# EAGLE design sterownik (EAGLE 5.06)
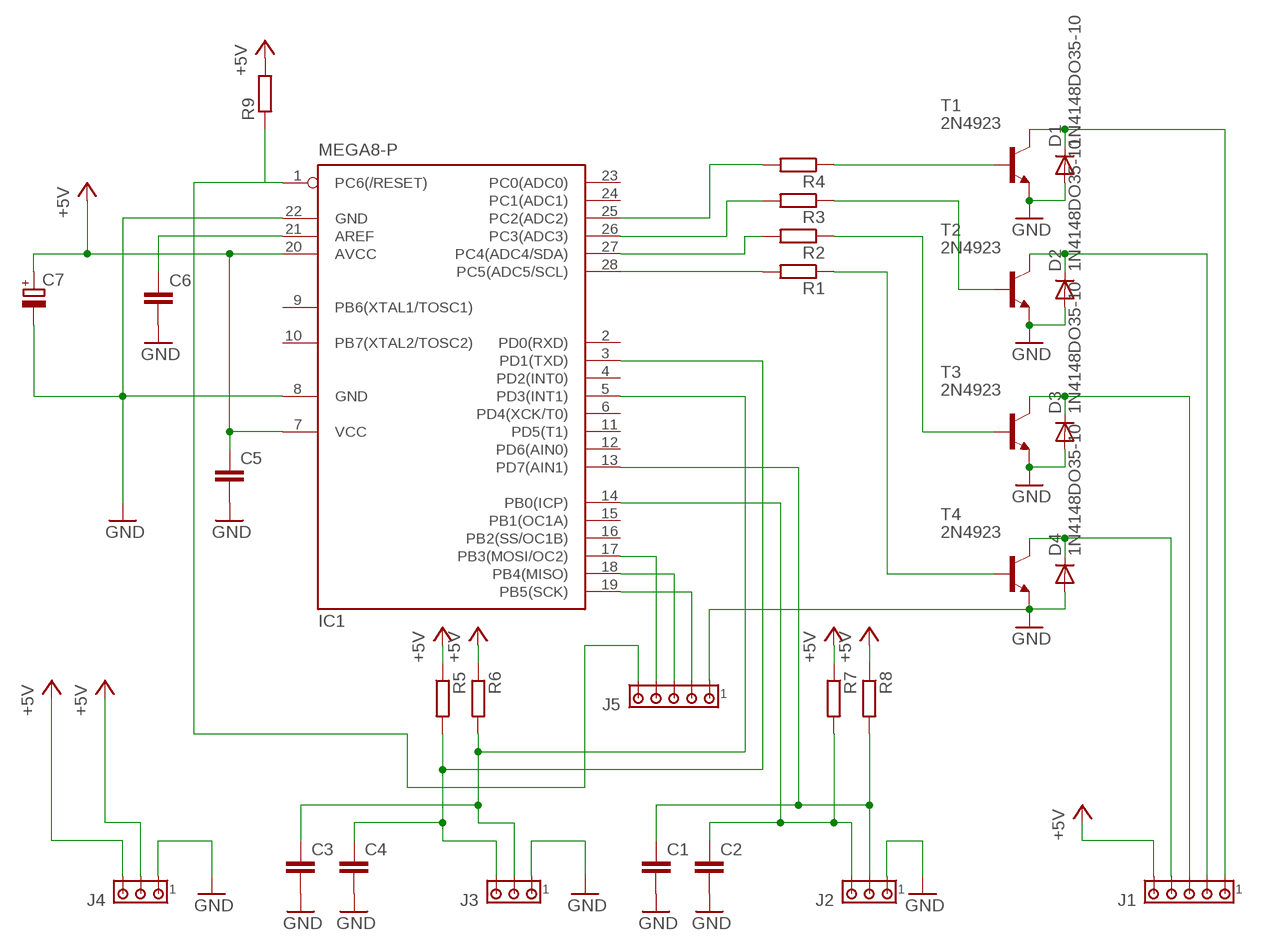
[diagram p0: schematic, sheet 1]

## Parts
C1  C-EU050-025X075  [C050-025X075]
C2  C-EU050-025X075  [C050-025X075]
C3  C-EU050-025X075  [C050-025X075]
C4  C-EU050-025X075  [C050-025X075]
C5  C-EU050-025X075  [C050-025X075]
C6  C-EU050-025X075  [C050-025X075]
C7  CPOL-EUE5-8.5  [E5-8,5]
D1  1N4148DO35-10  [DO35-10]
D2  1N4148DO35-10  [DO35-10]
D3  1N4148DO35-10  [DO35-10]
D4  1N4148DO35-10  [DO35-10]
IC1  MEGA8-P  [DIL28-3]
J1  MTA05-100  [10X05MTA]
J2  MTA03-100  [10X03MTA]
J3  MTA03-100  [10X03MTA]
J4  MTA03-100  [10X03MTA]
J5  MTA05-100  [10X05MTA]
R1  R-EU_0207/10  [0207/10]
R2  R-EU_0207/10  [0207/10]
R3  R-EU_0207/10  [0207/10]
R4  R-EU_0207/10  [0207/10]
R5  R-EU_0207/10  [0207/10]
R6  R-EU_0207/10  [0207/10]
R7  R-EU_0207/10  [0207/10]
R8  R-EU_0207/10  [0207/10]
R9  R-EU_0207/10  [0207/10]
T1  2N4923  [TO126]
T2  2N4923  [TO126]
T3  2N4923  [TO126]
T4  2N4923  [TO126]

## Nets
+5V: C5.1 C7.+ IC1.7(VCC) IC1.20(AVCC) J1.5 J4.2 J4.3 R5.1 R6.1 R7.1 R8.1 R9.2
GND: C1.2 C2.2 C3.2 C4.2 C5.2 C6.2 C7.- D1.A D2.A D3.A D4.A IC1.8(GND) IC1.22(GND) J2.1 J3.1 J4.1 J5.1 T1.1(E) T2.1(E) T3.1(E) T4.1(E)
N$1: IC1.28(PC5(ADC5/SCL)) R1.2
N$2: IC1.27(PC4(ADC4/SDA)) R2.2
N$3: IC1.26(PC3(ADC3)) R3.2
N$4: IC1.25(PC2(ADC2)) R4.2
N$5: R4.1 T1.3(B)
N$6: R3.1 T2.3(B)
N$7: R2.1 T3.3(B)
N$8: R1.1 T4.3(B)
N$9: IC1.1(PC6(/RESET)) J5.5 R9.1
N$11: C3.1 IC1.5(PD3(INT1)) J3.2 R6.2
N$12: D1.C J1.1 T1.2(C)
N$14: D2.C J1.2 T2.2(C)
N$15: D3.C J1.3 T3.2(C)
N$16: D4.C J1.4 T4.2(C)
N$21: IC1.19(PB5(SCK)) J5.2
N$22: IC1.18(PB4(MISO)) J5.3
N$23: C4.1 IC1.3(PD1(TXD)) J3.3 R5.2
N$24: IC1.17(PB3(MOSI/OC2)) J5.4
N$25: C1.1 IC1.13(PD7(AIN1)) J2.2 R8.2
N$26: C2.1 IC1.14(PB0(ICP)) J2.3 R7.2
N$29: C6.1 IC1.21(AREF)
Unconnected: IC1.2(PD0(RXD)) IC1.4(PD2(INT0)) IC1.6(PD4(XCK/T0)) IC1.9(PB6(XTAL1/TOSC1)) IC1.10(PB7(XTAL2/TOSC2)) IC1.11(PD5(T1)) IC1.12(PD6(AIN0)) IC1.15(PB1(OC1A)) IC1.16(PB2(SS/OC1B)) IC1.23(PC0(ADC0)) IC1.24(PC1(ADC1))

## Library data of the parts
C1-C6 = rcl:C-EU: CAPACITOR, European symbol
C7 = rcl:CPOL-EU: POLARIZED CAPACITOR, European symbol
D1-D4 = diode:1N4148: DIODE high speed (Philips)
IC1 = atmel:MEGA8-P: MICROCONTROLLER 8 Kbytes FLASH, 1 kbytes SRAM, 512 bytes EEPROM, USART, 4-channel 10 bit ADC, 2-channel 8 bit ADC Pin compatible with Atmega48, ATMega88, ATMega168 Source: avr.lbr
J1 J5 = con-amp:MTA05-100: AMP connector
J2-J4 = con-amp:MTA03-100: AMP connector
R1-R9 = rcl:R-EU_: RESISTOR, European symbol
T1-T4 = transistor:2N4923: NPN TRANSISTOR

## Board
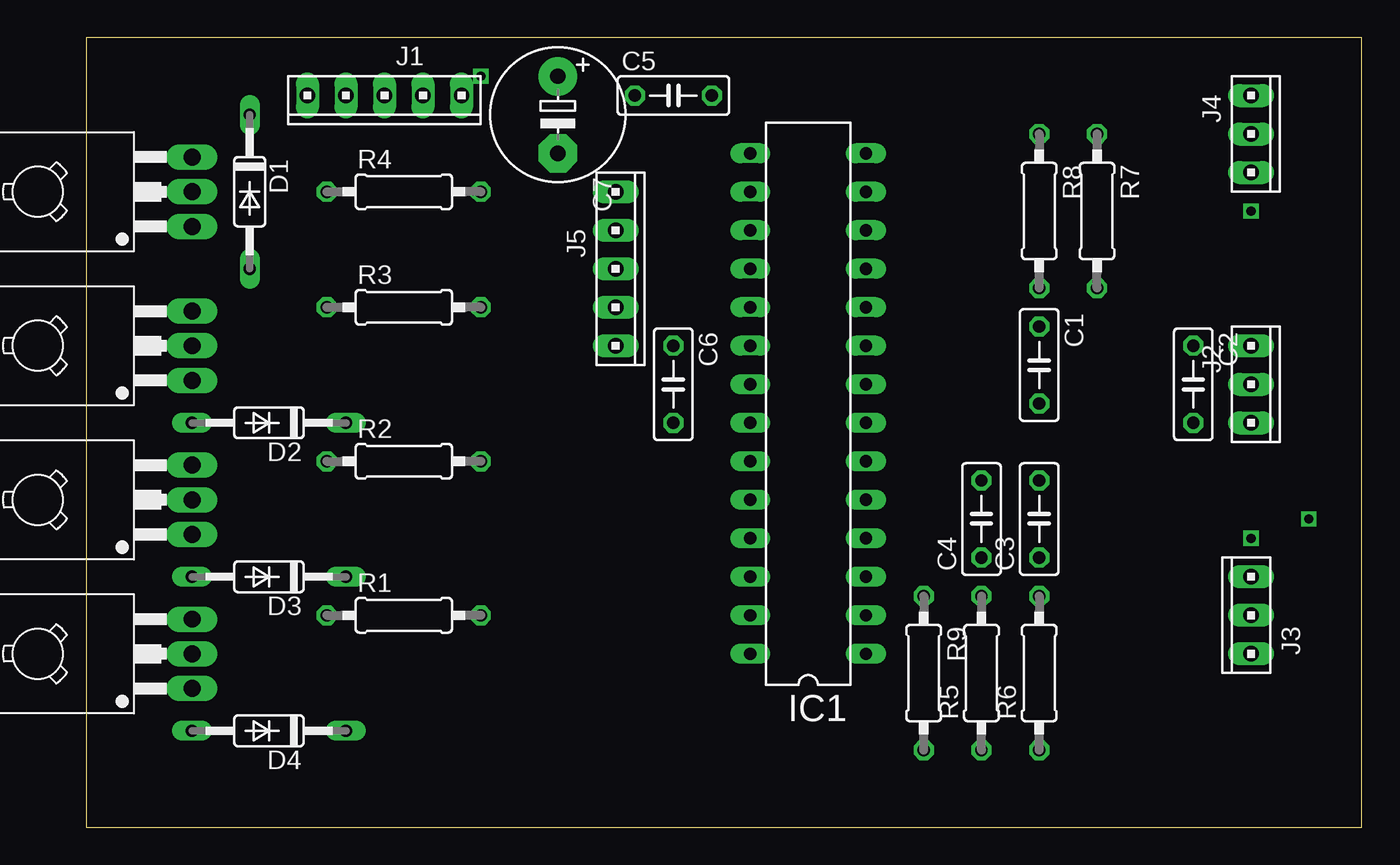
[diagram p1: board, top side]
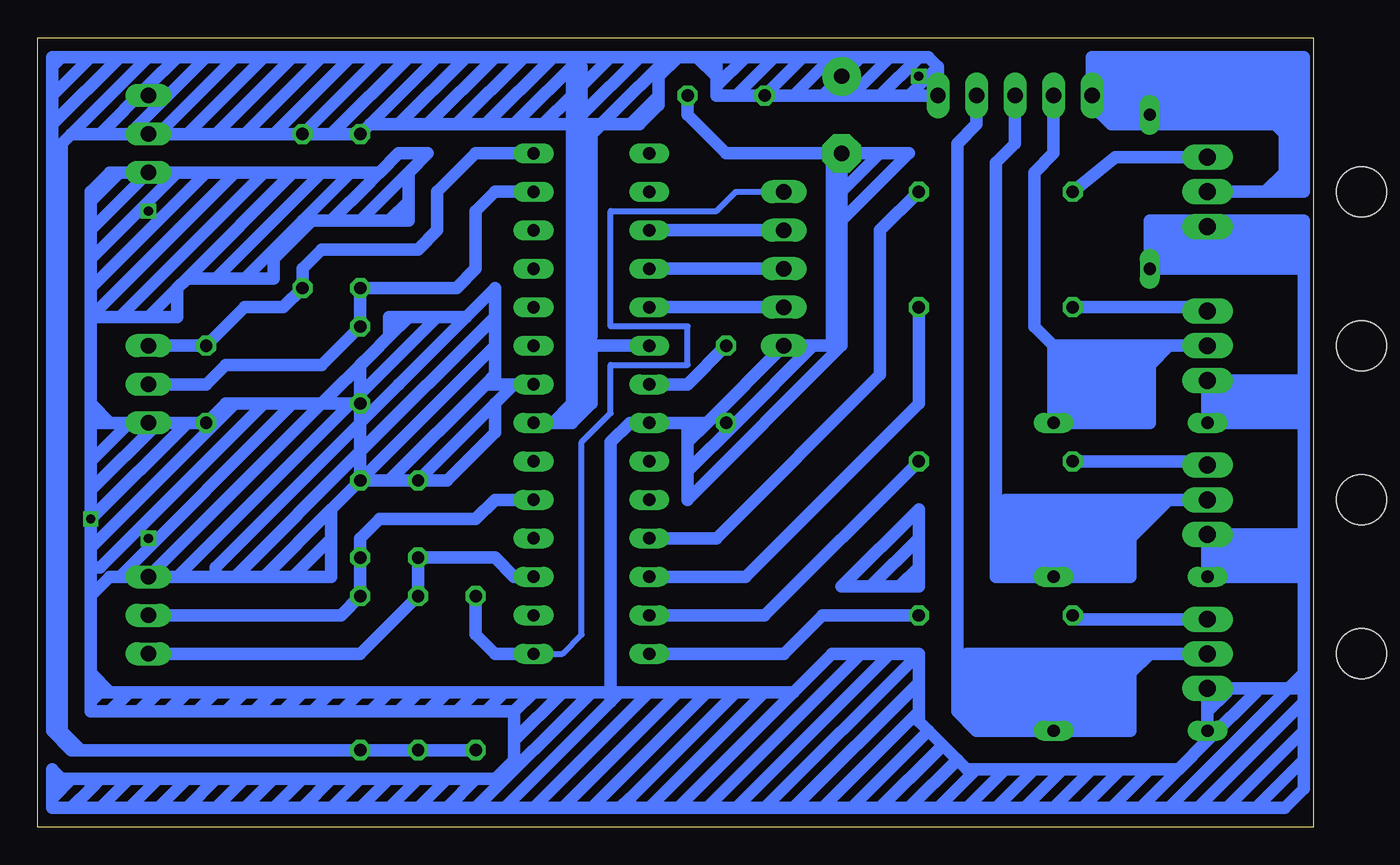
[diagram p2: board, bottom side, seen from below]

Size 84.12 x 52.06 mm. Coordinates in mm from the lower left corner, seen from the top.
Outline: 0,0 84.12,0 84.12,52.06 0,52.06 0,0
Copper layers (1*16): Top 0.035mm / dielectric 1.5mm / Bottom 0.035mm
Design rules "default": minimum track width 10mil, minimum drill 24mil, track to track 8mil, track to pad 8mil, pad to pad 8mil, via to via 8mil, smd to smd 8mil, copper to edge 40mil, drill to drill 8mil, minimum pad ring 10mil, minimum via ring 8mil, stop-mask expansion 4mil, vias tented up to drill 0mil, thermal gap 10mil

### Footprints (pad centres in the part's own frame; a part is rotated, then mirrored left to right if it is on the bottom)
C050-025X075 = drill 0.813 octagon: 1 -2.54,0; 2 2.54,0
E5-8,5 = drill 1.016 pad 2.54 round: + -2.54,0 | drill 1.016 pad 2.54 octagon: - 2.54,0
DO35-10 = drill 0.813 long: A 5.08,0; C -5.08,0
DIL28-3 = drill 0.813 long: 1 -16.51,-3.81; 2 -13.97,-3.81; 3 -11.43,-3.81; 4 -8.89,-3.81; 5 -6.35,-3.81; 6 -3.81,-3.81; 7 -1.27,-3.81; 8 1.27,-3.81; 9 3.81,-3.81; 10 6.35,-3.81; 11 8.89,-3.81; 12 11.43,-3.81; 13 13.97,-3.81; 14 16.51,-3.81; 15 16.51,3.81; 16 13.97,3.81; 17 11.43,3.81; 18 8.89,3.81; 19 6.35,3.81; 20 3.81,3.81; 21 1.27,3.81; 22 -1.27,3.81; 23 -3.81,3.81; 24 -6.35,3.81; 25 -8.89,3.81; 26 -11.43,3.81; 27 -13.97,3.81; 28 -16.51,3.81
10X05MTA = drill 1.016 long: 1 5.08,0; 2 2.54,0; 3 0,0; 4 -2.54,0; 5 -5.08,0
10X03MTA = drill 1.016 long: 1 2.54,0; 2 0,0; 3 -2.54,0
0207/10 = drill 0.813 octagon: 1 -5.08,0; 2 5.08,0
TO126 = drill 1.118 long: 1 -2.286,-5.08; 2 0,-5.08; 3 2.286,-5.08 | hole 3.302: 0,5.08

### Placement (x,y rotation side)
C1  62.86,30.48 270 top
C2  73.03,29.21 270 top
C3  62.86,20.32 90 top
C4  59.05,20.32 90 top
C5  38.73,48.26 0 top
C6  38.73,29.21 270 top
C7  31.12,46.99 270 top
D1  10.79,41.91 270 top
D2  12.07,26.67 180 top
D3  12.07,16.51 180 top
D4  12.07,6.35 180 top
IC1  47.62,27.94 90 top
J1  19.68,48.26 180 top
J2  76.83,29.21 270 top
J3  76.83,13.97 90 top
J4  76.83,45.72 270 top
J5  34.92,36.83 270 top
R1  20.95,13.97 0 top
R2  20.95,24.13 0 top
R3  20.95,34.29 0 top
R4  20.95,41.91 0 top
R5  59.05,10.16 90 top
R6  62.86,10.16 90 top
R7  66.67,40.64 270 top
R8  62.86,40.64 270 top
R9  55.24,10.16 270 top
T1  1.91,41.91 90 top
T2  1.91,31.75 90 top
T3  1.91,21.59 90 top
T4  1.91,11.43 90 top

### Tracks (layer width: path | path; a pad name or v marks a point on that pad's centre or on a via)
+5V
  Bottom 0.813: C5.1 34.29,48.26 | 32.38,48.26 31.12,48.26 | 31.12,48.26 30.48,48.26 | 28.57,48.26 26.67,48.26 | R6.1 R5.1 R9.2 81.28,5.08 | 81.28,5.08 81.91,5.08 83.19,6.35 83.19,44.45 | 82.55,45.09 83.19,44.45 | 82.55,45.09 81.91,45.72 | 72.39,45.72 70.48,45.72 | 70.48,45.72 68.58,45.72 | 68.58,45.72 R7.1 | 61.59,50.8 59.69,50.8 | 59.69,50.8 57.78,50.8 | 55.88,50.8 53.34,50.8 | 50.16,50.8 52.07,50.8 | 46.35,50.8 48.26,50.8 | 44.45,50.8 46.35,50.8 | 42.55,50.8 44.45,50.8 | 41.91,50.8 42.55,50.8 | 40.64,50.8 41.91,50.8 | 61.59,50.8 R7.1 | 47.62,31.75 48.89,33.02 48.89,33.66 | 47.62,31.75 IC1.20 | 48.89,48.26 48.89,50.8 | 48.89,48.26 48.89,33.66 | 48.89,26.67 50.16,26.67 | 50.16,26.67 IC1.7 | 48.89,26.67 47.62,27.94 47.62,31.75 | 31.12,48.26 C7.+ | 83.19,44.45 83.19,46.35 | 83.19,48.26 83.19,50.16 | 83.19,50.16 83.19,50.8 82.55,50.8 | 65.41,50.8 63.5,50.8 | 63.5,50.8 61.59,50.8 | R7.1 64.77,45.72 | 64.77,45.72 R8.1 | 68.58,45.72 63.5,50.8 | 48.26,33.66 48.26,33.02 | 48.26,46.35 48.26,33.66 | 48.26,46.35 48.26,50.16 | R8.1 62.23,46.35 60.32,46.35 | 56.52,46.35 58.42,46.35 | 64.77,45.72 59.69,50.8 | 57.78,50.8 R8.1 | 57.78,50.8 55.88,50.8 | 55.88,50.8 60.32,46.35 | 58.42,46.35 60.32,46.35 | 58.42,46.35 53.98,50.8 53.34,50.8 | 52.07,50.8 53.34,50.8 | 52.07,50.8 56.52,46.35 | 54.61,46.35 56.52,46.35 | 52.7,46.35 54.61,46.35 | 48.26,46.35 50.8,46.35 | 54.61,46.35 50.16,50.8 | 48.89,50.8 50.16,50.8 | 48.26,50.8 48.89,50.8 | 48.26,50.8 52.7,46.35 | 50.8,46.35 52.7,46.35 | 48.89,48.26 50.8,46.35 | 65.41,50.8 70.48,45.72 | 67.31,50.8 65.41,50.8 | 78.74,50.8 80.64,50.8 | 76.83,50.8 74.93,50.8 | 74.93,50.8 73.03,50.8 | 71.12,50.8 67.31,50.8 | 72.39,45.72 74.3,45.72 69.22,50.8 67.31,50.8 | 81.91,45.72 80.01,45.72
  Bottom 0.813: 78.11,45.72 J4.2 76.2,45.72 | 81.91,45.72 76.83,50.8 | 76.83,50.8 78.74,50.8 | 83.19,46.35 78.74,50.8 | 83.19,46.35 83.19,48.26 | 83.19,48.26 80.64,50.8 | 80.64,50.8 82.55,50.8 | 83.19,50.16 82.55,50.8 | 48.89,33.66 48.89,27.94 | 48.89,27.94 48.89,26.67 | 48.89,33.66 48.26,33.66 | 48.26,33.66 48.26,27.94 | 39.37,50.8 37.46,50.8 | 35.56,50.8 33.66,50.8 | 31.75,50.8 29.84,50.8 | 27.94,50.8 26.04,50.8 | 24.77,50.16 J1.5 26.67,48.26 | 24.77,50.16 26.67,48.26 | 24.77,50.16 25.4,50.8 26.04,50.8 | 26.04,50.8 28.57,48.26 | 30.48,48.26 28.57,48.26 | 27.94,50.8 30.48,48.26 | 29.84,50.8 27.94,50.8 | 29.84,50.8 32.38,48.26 | 34.29,48.26 32.38,48.26 | 31.75,50.8 34.29,48.26 | 33.66,50.8 31.75,50.8 | 33.66,50.8 C5.1 | 41.91,50.8 43.18,49.53 43.18,48.26 | 43.18,48.26 43.18,47.62 44.45,46.35 45.09,46.35 | 46.99,46.35 45.09,46.35 | 46.99,46.35 48.26,46.35 | 46.35,50.8 48.89,48.26 | 48.26,46.35 48.26,46.99 44.45,50.8 | 46.35,46.99 46.99,46.35 | 42.55,50.8 46.35,46.99 | 43.18,48.26 45.09,46.35 | 47.62,32.38 47.62,45.72 46.35,46.99 | 72.39,45.72 67.31,50.8 | 76.2,45.72 72.39,45.72 | 71.12,50.8 76.2,45.72 | 73.03,50.8 71.12,50.8 | 78.11,45.72 73.03,50.8 | 80.01,45.72 78.11,45.72 | 80.01,45.72 76.83,48.9 | 82.55,45.09 82.55,6.35 81.28,5.08 | 38.1,48.26 39.37,48.26 39.37,48.9 | 39.37,50.8 39.37,49.53 | 39.37,49.53 39.37,48.9 | 74.93,50.8 40.64,50.8 | 40.64,50.8 39.37,50.8 | 74.93,50.8 76.83,48.9 | 76.83,48.9 J4.3 | 38.1,48.26 C5.1 | 38.1,48.26 35.56,50.8 | 35.56,50.8 37.46,50.8 | 37.46,50.8 39.37,48.9 | 39.37,49.53 40.64,50.8 | 50.16,26.67 48.89,27.94
GND  (via drill 0.6)
  Bottom 0.813: 6.99,7.62 D4.A 6.99,5.71 | 6.99,7.62 T4.1 0.89,9.14 0.64,8.89 | 0.64,8.89 0.64,10.16 | 0.64,10.16 0.64,16.51 | 0.64,16.51 D3.A 6.99,17.14 | 6.99,17.78 6.99,18.41 | 6.99,19.05 T3.1 0.89,19.3 0.64,19.05 | 0.64,19.05 0.64,26.67 | 0.64,26.67 D2.A 6.99,27.3 | 6.99,27.94 6.99,28.57 | 6.99,29.21 T2.1 0.89,29.46 0.64,29.21 | 0.64,29.21 0.64,36.83 | 3.17,1.27 2.54,1.27 | 9.53,1.27 11.43,1.27 | 11.43,1.27 13.34,1.27 | 13.34,1.27 15.24,1.27 | 15.24,1.27 17.14,1.27 | 17.14,1.27 19.05,1.27 | 19.05,1.27 20.95,1.27 | 20.95,1.27 22.86,1.27 | 22.86,1.27 24.77,1.27 | 24.77,1.27 26.67,1.27 | 26.67,1.27 28.57,1.27 | 28.57,1.27 30.48,1.27 | 30.48,1.27 32.38,1.27 | 32.38,1.27 34.92,1.27 | 34.92,1.27 36.2,1.27 | 36.2,1.27 38.1,1.27 | 38.1,1.27 40,1.27 | 40,1.27 41.91,1.27 | 41.91,1.27 43.81,1.27 | 43.81,1.27 45.09,1.27 | 45.09,1.27 45.72,1.27 | 41.27,26.67 IC1.22 45.09,26.67 46.35,25.4 46.35,8.89 | 38.1,26.67 C6.2 38.73,26.03 | 54.61,29.21 53.98,29.21 | 60.96,22.86 54.61,29.21 | 60.96,22.86 C4.2 | C3.2 60.96,22.86 | 62.86,24.77 C3.2 | 62.86,26.67 62.86,24.77 | 71.12,27.94 71.75,27.94 C2.2 74.3,26.67 | 69.22,27.94 71.12,27.94 | 67.31,27.94 65.41,27.94 | 65.41,27.94 63.5,27.94 | 63.5,27.94 C1.2 | 74.3,26.67 76.2,26.67 | 76.2,26.67 J2.1 | 80.64,26.67 J2.1 | 78.74,43.18 79.38,43.18 80.64,41.91 80.64,41.27 | 80.64,28.57 80.64,27.94 79.38,26.67 78.11,26.67 | 80.64,28.57 80.64,33.66 | J2.1 78.11,26.67 | 31.12,31.75 31.12,40.01 | 31.12,40.01 31.12,41.91 | C7.- 31.12,41.91 | C5.2 41.27,46.99 38.73,44.45 31.75,44.45 | 31.75,44.45 C7.- | 52.7,7.62 54.61,7.62 | 56.52,7.62 58.42,7.62 | 60.32,7.62 62.23,7.62 | 64.14,7.62 66.04,7.62 | 67.94,7.62 69.85,7.62 | 72.39,7.62 73.66,7.62 | 75.56,7.62 77.47,7.62
  Bottom 0.813: 79.38,7.62 80.64,7.62 80.64,8.26 | 80.64,8.89 80.64,10.16 | 80.64,10.16 80.64,15.24 | 80.64,15.24 79.38,16.51 78.74,16.51 | 0.64,36.83 5.08,36.83 | 5.08,36.83 5.71,36.83 6.99,38.1 | 6.99,39.37 T1.1 | 8.89,36.83 D1.A | 8.89,3.81 10.79,3.81 | 10.79,3.81 12.7,3.81 | 12.7,3.81 14.61,3.81 | 14.61,3.81 16.51,3.81 | 16.51,3.81 18.41,3.81 | 18.41,3.81 20.32,3.81 | 20.32,3.81 22.22,3.81 | 22.22,3.81 22.86,3.81 23.49,4.45 | 23.49,4.45 25.4,6.35 | 25.4,6.35 26.04,6.98 26.04,7.62 | 26.04,7.62 26.04,9.52 | 26.04,9.52 26.04,11.43 | 26.04,11.43 27.94,11.43 | 27.94,11.43 29.84,11.43 | 29.84,11.43 31.75,11.43 34.29,8.89 | 34.29,8.89 36.2,8.89 | 36.2,8.89 38.1,8.89 | 38.1,8.89 40,8.89 | 40,8.89 41.91,8.89 | 11.43,1.27 8.89,3.81 | 13.34,1.27 10.79,3.81 | 15.24,1.27 12.7,3.81 | 17.14,1.27 14.61,3.81 | 19.05,1.27 16.51,3.81 | 20.95,1.27 18.41,3.81 | 22.86,1.27 20.32,3.81 | 24.77,1.27 22.22,3.81 | 26.67,1.27 23.49,4.45 | 28.57,1.27 24.77,5.08 | 25.4,6.35 30.48,1.27 | 32.38,1.27 26.04,7.62 | 26.04,9.52 34.29,1.27 34.92,1.27 | 36.2,1.27 26.04,11.43 | 38.1,1.27 27.94,11.43 | 40,1.27 29.84,11.43 | 41.91,1.27 34.29,8.89 | 43.81,1.27 36.2,8.89 | 45.09,1.9 38.1,8.89 | 45.09,1.27 45.09,1.9 | C3.2 64.77,20.95 | 64.77,20.95 64.77,19.05 | 64.77,19.05 64.77,16.51 67.31,16.51 | 69.22,16.51 67.31,16.51 | 71.12,16.51 69.22,16.51 | 72.39,16.51 71.12,16.51 | 74.93,16.51 72.39,16.51 | 78.74,16.51 J3.1 | J3.1 74.93,16.51 | 69.22,16.51 64.77,20.95 | 67.31,16.51 64.77,19.05 | 71.12,16.51 62.86,24.77 | 62.86,26.67 72.39,17.14 72.39,16.51 | 74.93,16.51 63.5,27.94 | J3.1 65.41,27.94 | 78.74,16.51 67.31,27.94 | 67.31,27.94 69.22,27.94 | 80.64,18.41 71.12,27.94 | 80.64,15.24 80.64,17.14 | 80.64,17.14 80.64,18.41 | 80.64,18.41 v80.64,20.32
  Bottom 0.813: v80.64,20.32 80.64,22.23 | 80.64,22.23 80.64,26.67 | 80.64,26.67 80.64,24.13 78.11,26.67 | 80.64,26.67 80.64,28.57 | 69.22,27.94 80.01,17.14 80.64,17.14 | v80.64,20.32 74.3,26.67 | C4.2 57.15,22.86 53.98,26.03 53.98,27.94 | 53.98,27.94 52.7,29.21 IC1.8 53.98,29.21 | C4.2 53.98,27.94 | 8.89,3.81 6.99,5.71 | 0.64,8.26 0.64,8.89 | 0.64,6.35 0.64,8.26 | 0.64,4.45 0.64,6.35 | 0.64,4.45 0.64,2.54 1.91,1.27 3.17,1.27 | 3.17,1.27 3.81,1.27 | 3.81,1.27 5.71,1.27 | 5.71,1.27 7.62,1.27 | 7.62,1.27 9.53,1.27 | 9.53,1.27 0.64,10.16 | 7.62,1.27 0.64,8.26 | 0.64,6.35 5.71,1.27 | 3.81,1.27 0.64,4.45 | 6.99,5.71 3.81,8.89 | 6.99,7.62 5.71,8.89 | 0.64,18.41 0.64,19.05 | 0.64,17.14 0.64,17.78 | 0.64,16.51 0.64,17.14 | 0.64,17.14 6.99,17.14 | 6.99,17.14 6.99,17.78 | 0.64,17.78 6.99,17.78 | 0.64,17.78 0.64,18.41 | 0.64,18.41 6.99,18.41 | 6.99,18.41 6.99,19.05 | 6.99,19.05 1.27,19.05 | 0.64,26.67 0.64,29.21 | 0.64,29.21 6.99,29.21 | 6.99,29.21 6.99,28.57 | 6.99,28.57 1.27,28.57 1.27,27.94 6.99,27.94 | 6.99,27.3 6.99,27.94 | 6.99,27.3 1.27,27.3 | 6.99,39.37 6.35,40.01 5.71,40.01 | 5.71,40.01 0.64,40.01 0.64,36.83 | 0.64,36.83 1.27,37.46 5.71,37.46 6.35,38.1 | 6.35,38.1 6.35,39.37 | 6.35,39.37 1.27,39.37 1.27,38.1 5.71,38.1 5.71,38.73 1.91,38.73 | 7.62,36.83 8.26,36.83 | 5.08,36.83 7.62,36.83 | 7.62,36.83 6.35,38.1 | 6.99,39.37 8.89,37.46 8.89,36.83 | 8.26,36.83 8.89,36.83 | 8.26,36.83 6.99,38.1 | 6.99,38.1 6.99,39.37 | 6.99,38.1 7.62,37.46 8.26,37.46 | 8.26,37.46 7.62,38.1 | 8.26,37.46 10.79,37.46 10.79,40.01 5.71,40.01 | 5.71,40.01 6.35,39.37 | 6.35,39.37 10.16,39.37 10.16,38.1 8.89,38.1 8.26,38.73 9.53,38.73 | 74.93,43.18 J4.1 | 71.12,43.18 73.03,43.18 | 69.22,43.18 67.31,43.18
  Bottom 0.813: 67.31,43.18 65.41,43.18 | 63.5,43.18 62.23,43.18 | 62.23,43.18 61.59,43.18 | 58.42,44.45 59.69,43.18 59.69,41.27 | 59.69,41.27 59.69,40.01 60.96,40.01 | 64.77,40.01 62.86,40.01 | 64.77,40.01 66.04,40.01 68.58,37.46 68.58,36.2 70.48,36.2 | 72.39,36.2 70.48,36.2 | 74.3,36.2 72.39,36.2 | 74.3,36.2 74.93,35.56 74.93,33.66 76.83,33.66 | 80.64,33.66 78.74,33.66 | 67.31,43.18 74.3,36.2 | 76.83,33.66 67.31,43.18 | 78.74,33.66 76.83,33.66 | 78.74,33.66 69.22,43.18 | 71.12,43.18 69.22,43.18 | 80.64,33.66 71.12,43.18 | 80.64,33.66 80.64,35.56 | 80.64,35.56 80.64,37.46 | 80.64,39.37 80.64,41.27 | 80.64,35.56 73.03,43.18 | 73.03,43.18 74.93,43.18 | 80.64,37.46 74.93,43.18 | 80.64,37.46 80.64,39.37 | 80.64,39.37 J4.1 | J4.1 78.74,43.18 | 80.64,41.27 78.74,43.18 | 65.41,43.18 72.39,36.2 | 65.41,43.18 63.5,43.18 | 63.5,43.18 70.48,36.2 | 70.48,36.2 66.67,40.01 64.77,40.01 | 62.23,42.54 64.77,40.01 | 62.23,43.18 62.23,42.54 | 61.59,43.18 62.23,42.54 | 61.59,43.18 60.32,44.45 58.42,44.45 | 58.42,44.45 62.86,40.01 | 62.86,40.01 60.96,40.01 | 60.96,40.01 59.69,41.27 | 49.53,1.27 51.44,1.27 | 51.44,1.27 53.34,1.27 | 53.34,1.27 55.24,1.27 | 55.24,1.27 57.15,1.27 | 83.19,1.9 83.19,1.27 81.91,1.27 | 83.19,1.9 83.19,3.81 82.55,3.17 81.91,3.17 | 59.05,3.17 60.96,3.17 | 55.24,3.17 57.15,3.17 | 55.24,3.17 53.98,3.17 | 53.98,3.17 53.34,3.17 | 53.98,3.17 52.7,4.45 52.7,5.71 | 57.15,1.27 55.24,3.17 | 57.15,1.27 59.05,1.27 | 59.05,1.27 60.96,1.27 | 62.86,1.27 64.77,1.27 | 66.67,1.27 68.58,1.27 | 70.48,1.27 72.39,1.27 | 74.3,1.27 76.2,1.27 | 78.11,1.27 80.01,1.27 | 59.05,1.27 57.15,3.17 | 57.15,3.17 59.05,3.17 | 60.96,1.27 59.05,3.17 | 60.96,1.27 62.86,1.27 | 62.86,1.27 60.96,3.17 | 60.96,3.17 62.86,3.17
  Bottom 0.813: 74.3,3.17 76.2,3.17 | 70.48,3.17 72.39,3.17 | 66.67,3.17 68.58,3.17 | 62.86,3.17 64.77,3.17 | 64.77,1.27 62.86,3.17 | 64.77,1.27 66.67,1.27 | 66.67,1.27 64.77,3.17 | 64.77,3.17 66.67,3.17 | 68.58,1.27 66.67,3.17 | 68.58,1.27 70.48,1.27 | 70.48,1.27 68.58,3.17 | 68.58,3.17 70.48,3.17 | 72.39,1.27 70.48,3.17 | 72.39,1.27 74.3,1.27 | 74.3,1.27 72.39,3.17 | 72.39,3.17 74.3,3.17 | 76.2,1.27 74.3,3.17 | 76.2,1.27 78.11,1.27 | 78.11,1.27 76.2,3.17 | 76.2,3.17 78.11,3.17 | 80.64,3.17 81.91,3.17 | 80.01,3.17 80.64,3.17 | 78.11,3.17 80.01,3.17 | 80.01,1.27 78.11,3.17 | 80.01,1.27 81.91,1.27 | 81.91,1.27 80.64,2.54 | 80.64,2.54 80.64,3.17 | 80.64,2.54 80.01,3.17 | 80.01,3.17 81.91,3.17 | 81.91,3.17 83.19,1.9 | 45.72,1.27 45.09,1.9 | 45.72,1.27 47.62,1.27 | 47.62,1.27 49.53,1.27 | 40,8.89 47.62,1.27 | 49.53,1.27 41.91,8.89 | 41.91,8.89 43.81,8.89 | 43.81,8.89 51.44,1.27 | 43.81,8.89 45.72,8.89 | 45.72,8.89 46.35,8.89 | 46.35,8.26 46.35,8.89 | 40,26.67 J5.1 33.02,31.75 | 41.27,26.67 41.27,25.4 | 41.27,26.67 40,26.67 | 38.73,26.03 38.1,26.67 | 33.02,31.75 31.75,31.75 | 31.75,31.75 31.12,31.75 | 38.1,26.67 33.02,31.75 | 41.27,25.4 40,26.67 | 41.27,25.4 41.27,23.49 | 41.27,23.49 38.73,26.03 | 31.12,31.75 41.27,21.59 41.27,23.49 | 41.27,23.49 38.1,26.67 | 31.75,31.75 31.75,44.45 | C7.- 28.57,44.45 | 28.57,44.45 26.67,44.45 31.12,40.01 | 31.12,41.91 28.57,44.45 | C1.2 62.86,30.48 62.23,31.12 | 62.23,31.12 60.96,32.38 | 60.96,32.38 60.96,33.66 59.69,33.66 | 59.69,33.66 57.78,33.66 | 57.78,33.66 55.88,33.66 | 55.88,33.66 53.98,35.56 | 53.98,29.84 53.98,29.21 | 60.32,29.21 55.88,33.66 | C1.2 62.86,28.57 57.78,33.66 | 60.96,32.38 59.69,33.66 | 54.61,29.21 53.98,29.84 | 53.98,31.75 53.98,29.84 | C3.2 53.98,31.75
  Bottom 0.813: 53.98,33.66 53.98,31.75 | 62.86,24.77 53.98,33.66 | 53.98,33.66 53.98,35.56 | 60.32,29.21 53.98,35.56 | 62.86,26.67 60.32,29.21 | C1.2 62.86,26.67 | 65.41,27.94 62.23,31.12 | 80.64,22.23 76.2,26.67 | 46.35,8.89 47.62,8.89 | 49.53,8.89 51.44,8.89 | 78.11,8.89 78.74,8.89 | 78.74,8.89 80.01,8.89 | 78.74,8.89 79.38,8.89 80.64,10.16 | 53.34,1.27 46.35,8.26 | 45.72,8.89 47.62,8.89 | 47.62,8.89 55.24,1.27 | 47.62,8.89 49.53,8.89 | 49.53,8.89 52.7,5.71 | 52.7,5.71 52.7,7.62 | 46.35,8.26 45.72,8.89 | 45.72,8.89 51.44,8.89 | 51.44,8.89 53.34,8.89 | 53.34,8.89 55.24,8.89 | 55.24,8.89 59.05,8.89 | 59.05,8.89 62.86,8.89 | 62.86,8.89 66.67,8.89 | 66.67,8.89 70.48,8.89 | 70.48,8.89 74.3,8.89 | 74.3,8.89 78.11,8.89 | 80.01,8.89 80.64,8.89 | 80.64,8.89 80.64,8.26 | 51.44,8.89 52.7,7.62 | 53.34,8.89 54.61,7.62 | 54.61,7.62 56.52,7.62 | 56.52,7.62 55.24,8.89 | 55.24,8.89 57.15,8.89 58.42,7.62 | 58.42,7.62 60.32,7.62 | 60.32,7.62 59.05,8.89 | 59.05,8.89 60.96,8.89 62.23,7.62 | 62.23,7.62 64.14,7.62 | 64.14,7.62 62.86,8.89 | 62.86,8.89 64.77,8.89 66.04,7.62 | 66.04,7.62 67.94,7.62 | 67.94,7.62 66.67,8.89 | 66.67,8.89 68.58,8.89 69.85,7.62 | 69.85,7.62 72.39,7.62 | 72.39,7.62 71.75,7.62 70.48,8.89 | 70.48,8.89 72.39,8.89 73.66,7.62 | 73.66,7.62 75.56,7.62 | 75.56,7.62 74.3,8.89 | 74.3,8.89 76.2,8.89 77.47,7.62 | 77.47,7.62 79.38,7.62 | 79.38,7.62 78.11,8.89 | 78.11,8.89 80.01,8.89 | 80.01,8.89 80.64,8.26
N$1
  Bottom 0.813: R1.2 32.38,13.97 34.92,11.43 IC1.28
N$2
  Bottom 0.813: R2.2 36.2,13.97 IC1.27
N$3
  Bottom 0.813: IC1.26 37.46,16.51 26.04,27.94 R3.2
N$4
  Bottom 0.813: IC1.25 39.37,19.05 28.57,29.84 28.57,39.37 R4.2
N$5
  Bottom 0.813: T1.3 13.08,44.2 R4.1
N$6
  Bottom 0.813: R3.1 7.24,34.29 T2.3
N$7
  Bottom 0.813: R2.1 7.24,24.13 T3.3
N$8
  Bottom 0.813: T4.3 15.62,13.72 R1.1
N$9
  Bottom 0.406: IC1.1 49.53,11.43 48.26,12.7 48.26,25.4 46.35,27.3 46.35,30.48 41.27,30.48 41.27,33.02 46.35,33.02 46.35,40.64 39.37,40.64 38.1,41.91 J5.5
  Bottom 0.813: R9.1 55.24,12.7 53.98,11.43 IC1.1
N$10  (via drill 0.6)
  other vias: 76.83,19.05
N$11
  Bottom 0.813: J3.2 64.14,13.97 R6.2 C3.1 62.86,19.05 61.59,20.32 55.24,20.32 53.98,21.59 IC1.5
N$12
  Bottom 0.813: 10.79,46.35 13.34,46.35 14.61,47.62 J1.1 | 3.17,41.91 T1.2 | 3.17,41.91 1.91,43.18 1.91,45.72 | 1.91,45.72 1.91,46.99 3.17,48.26 3.81,48.26 | 4.44,48.26 10.79,48.26 | 10.79,48.26 J1.1 | 10.79,48.26 10.79,47.62 | 3.17,41.91 0.64,41.91 0.64,50.8 14.61,50.8 J1.1 | J1.1 4.44,48.26 | 3.81,48.26 2.54,48.26 1.91,47.62 1.27,47.62 1.27,42.54 1.91,42.54 1.27,43.18 1.27,50.8 13.97,50.8 13.97,48.9 1.91,48.9 | 1.91,48.9 1.91,48.26 | 1.91,48.9 1.91,49.53 | 1.91,49.53 1.91,50.16 13.34,50.16 13.34,49.53 1.91,49.53 | 1.91,45.72 2.54,46.35 | 2.54,46.35 3.17,46.99 | 3.17,46.99 3.81,47.62 | 3.81,47.62 4.44,48.26 | 4.44,48.26 3.81,48.26 | 3.81,48.26 2.54,46.99 2.54,46.35 | 2.54,46.35 10.16,46.35 | 10.16,46.35 D1.C | 3.17,46.99 9.53,46.99 | 9.53,46.99 D1.C | D1.C 10.79,47.62 | 10.79,47.62 10.16,47.62 | 10.16,47.62 3.81,47.62 | J1.1 13.97,47.62 10.16,47.62 | 10.16,47.62 10.16,46.35 | 10.16,46.35 12.7,46.35 13.34,46.99 9.53,46.99
N$14
  Bottom 0.813: 11.43,26.67 10.79,26.67 10.79,30.48 9.53,31.75 | 16.51,26.67 D2.C 17.14,31.75 | T2.2 9.53,31.75 | J1.2 17.14,44.45 18.41,43.18 18.41,33.02 17.14,31.75 | 9.53,31.75 16.51,31.75 | 17.14,31.75 16.51,31.75 | 16.51,31.75 16.51,26.67 | 16.51,26.67 11.43,26.67 | 11.43,26.67 11.43,31.12 | 11.43,31.12 10.79,31.12 | 11.43,31.12 15.88,31.12 15.88,27.3 12.07,27.3 12.07,30.48 15.24,30.48 15.24,27.94 12.7,27.94 12.7,29.84 14.61,29.84 14.61,28.57 13.34,28.57 13.34,29.21 13.97,29.21
N$15
  Bottom 0.813: T3.2 8.89,21.59 | 8.89,21.59 9.53,21.59 12.07,19.05 12.07,16.51 D3.C 20.95,16.51 20.95,43.82 19.68,45.09 J1.3 | 8.89,21.59 20.32,21.59 20.32,17.14 12.7,17.14 12.7,17.78 | 12.7,17.78 12.7,19.05 10.79,20.95 19.68,20.95 19.68,17.78 12.7,17.78 | 12.7,17.78 13.34,18.41 13.34,19.05 12.07,20.32 19.05,20.32 19.05,18.41 13.97,18.41 13.97,19.05 13.34,19.69 18.41,19.69 18.41,19.05 14.61,19.05
N$16
  Bottom 0.813: 10.79,11.43 12.07,10.16 12.07,6.35 D4.C 22.22,6.35 23.49,7.62 23.49,45.09 22.22,46.35 J1.4 | T4.2 10.79,11.43 | 10.79,11.43 22.86,11.43 22.86,10.8 | 22.86,10.8 22.86,8.26 22.22,7.62 | 21.59,6.98 22.22,7.62 | 22.22,7.62 22.86,7.62 22.22,6.98 12.7,6.98 12.7,10.16 12.07,10.8 22.22,10.8 | 22.86,10.8 22.22,10.8 | 22.22,10.8 22.22,8.89 21.59,8.26 | 20.95,7.62 21.59,8.26 | 21.59,8.26 22.22,8.26 21.59,7.62 13.34,7.62 13.34,10.16 21.59,10.16 21.59,8.89 20.95,8.26 13.97,8.26 13.97,8.89 | 13.97,8.89 13.97,9.52 20.95,9.52 20.95,8.89 13.97,8.89
N$17  (via drill 0.6)
  other vias: 76.83,40.64
N$18  (via drill 0.6)
  other vias: 26.04,49.53
N$19
  Bottom 0.813: 26.04,19.05 26.04,17.14 | 26.04,17.14 26.04,15.88 27.3,15.88 | 29.21,15.88 31.12,15.88 26.04,20.95 26.04,19.05 | 26.04,19.05 29.21,15.88 | 29.21,15.88 27.3,15.88 | 27.3,15.88 26.04,17.14
N$21
  Bottom 0.813: J5.2 IC1.19
N$22
  Bottom 0.813: J5.3 IC1.18
N$23
  Bottom 0.813: J3.3 62.86,11.43 R5.2 C4.1 53.98,17.78 52.7,16.51 IC1.3
N$24
  Bottom 0.813: J5.4 IC1.17
N$25
  Bottom 0.813: J2.2 73.03,29.21 71.75,30.48 65.41,30.48 C1.1 | C1.1 62.86,34.29 | C1.1 R8.2 56.52,35.56 55.24,36.83 55.24,40.64 53.98,41.91 IC1.13
N$26
  Bottom 0.813: IC1.14 55.24,44.45 57.78,41.91 57.78,39.37 59.05,38.1 65.41,38.1 66.67,36.83 R7.2 67.94,34.29 70.48,34.29 C2.1 J2.3
N$29
  Bottom 0.813: IC1.21 41.27,29.21 C6.1